# EAGLE design RC_Engine_Sound_ESP32 (EAGLE 9.6.2)
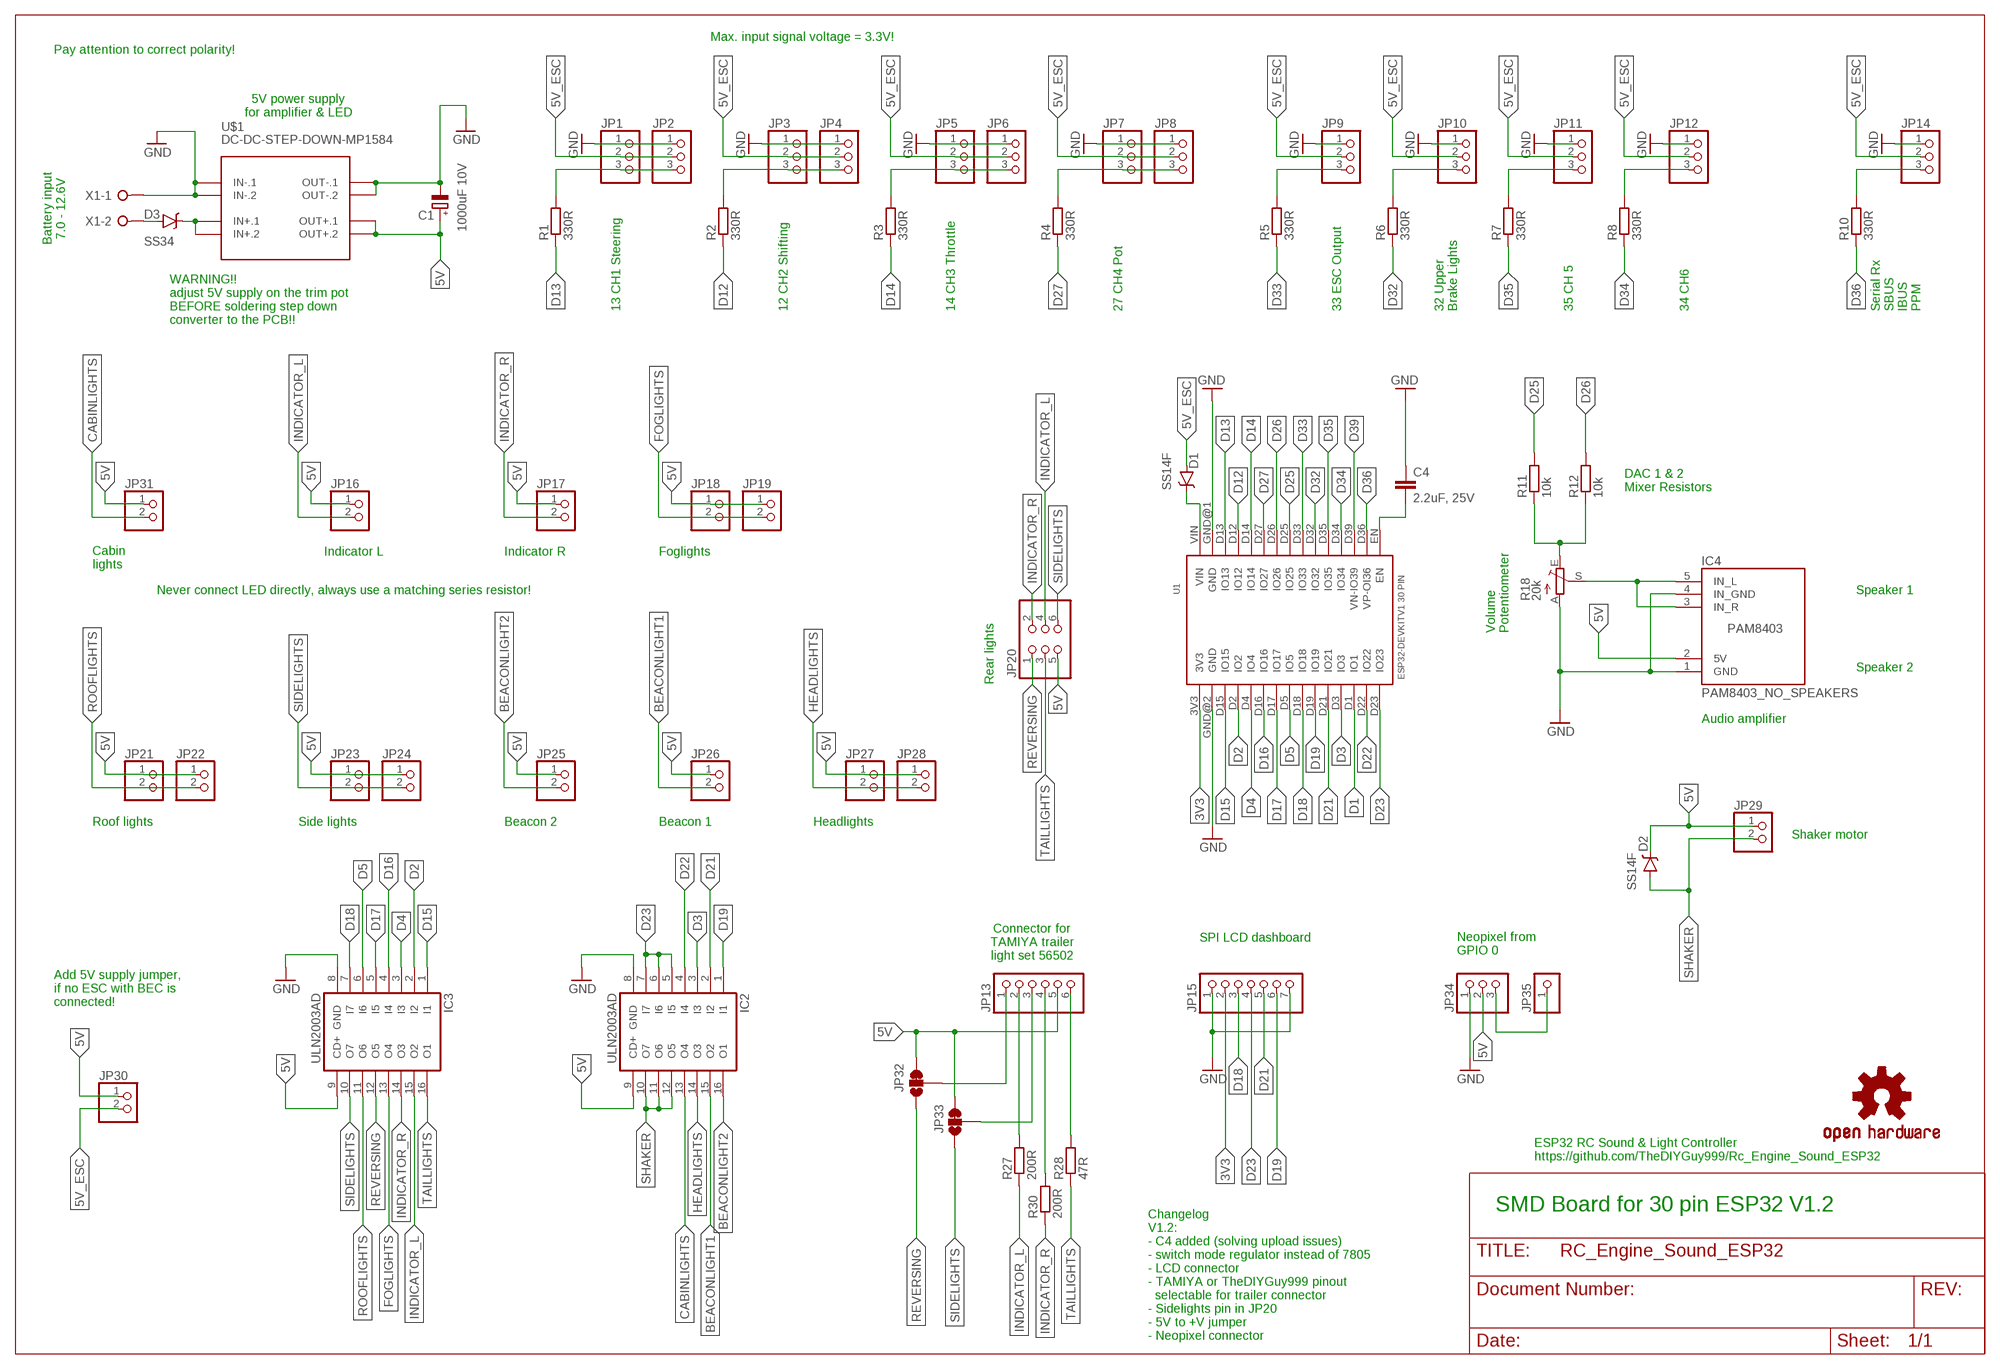
[diagram p0: schematic, sheet 1]

## Parts
C1  1000uF 10V  CPOL-EUUD-10X10  [UD-10X10_NICHICON]
C4  2.2uF, 25V  C-EUC1206  [C1206]
D1  SS14F  MBRA140  [SMA-DIODE]
D2  SS14F  MBRA140  [SMA-DIODE]
D3  SS34  MBRA140  [SMA-DIODE]
IC2  ULN2003AD  [SO16]
IC3  ULN2003AD  [SO16]
IC4  PAM8403_NO_SPEAKERS  [PAM8403_NO_SPEAKERS]
JP1  PINHD-1X3  [1X03]
JP2  PINHD-1X3  [1X03]
JP3  PINHD-1X3  [1X03]
JP4  PINHD-1X3  [1X03]
JP5  PINHD-1X3  [1X03]
JP6  PINHD-1X3  [1X03]
JP7  PINHD-1X3  [1X03]
JP8  PINHD-1X3  [1X03]
JP9  PINHD-1X3  [1X03]
JP10  PINHD-1X3  [1X03]
JP11  PINHD-1X3  [1X03]
JP12  PINHD-1X3  [1X03]
JP13  PINHD-1X6  [1X06]
JP14  PINHD-1X3  [1X03]
JP15  PINHD-1X7  [1X07]
JP16  PINHD-1X2  [1X02]
JP17  PINHD-1X2  [1X02]
JP18  PINHD-1X2  [1X02]
JP19  PINHD-1X2  [1X02]
JP20  PINHD-2X3  [2X03]
JP21  PINHD-1X2  [1X02]
JP22  PINHD-1X2  [1X02]
JP23  PINHD-1X2  [1X02]
JP24  PINHD-1X2  [1X02]
JP25  PINHD-1X2  [1X02]
JP26  PINHD-1X2  [1X02]
JP27  PINHD-1X2  [1X02]
JP28  PINHD-1X2  [1X02]
JP29  PINHD-1X2  [1X02]
JP30  PINHD-1X2  [1X02]
JP31  PINHD-1X2  [1X02]
JP32  JUMPER-PAD-3-2OF3_NC_BY_TRACE_LARGE  [PAD-JUMPER-3-2OF3_NC_BY_TRACE_YES_SILK_LARGE]
JP33  JUMPER-PAD-3-2OF3_NC_BY_TRACE_LARGE  [PAD-JUMPER-3-2OF3_NC_BY_TRACE_YES_SILK_LARGE]
JP34  PINHD-1X3  [1X03]
JP35  PINHD-1X1  [1X01]
LOGO1  OSHW-LOGOM  [OSHW-LOGO-M]
R1  330R  R-EU_R0805  [R0805]
R2  330R  R-EU_R0805  [R0805]
R3  330R  R-EU_R0805  [R0805]
R4  330R  R-EU_R0805  [R0805]
R5  330R  R-EU_R0805  [R0805]
R6  330R  R-EU_R0805  [R0805]
R7  330R  R-EU_R0805  [R0805]
R8  330R  R-EU_R0805  [R0805]
R10  330R  R-EU_R0805  [R0805]
R11  10k  R-EU_R0805  [R0805]
R12  10k  R-EU_R0805  [R0805]
R18  20k  TRIM_EU-S64W  [S64W]
R27  200R  R-EU_R0805  [R0805]
R28  47R  R-EU_R0805  [R0805]
R30  200R  R-EU_R0805  [R0805]
U1  ESP32DEVKITV1  [ESP32-DEVKITV1]
U$1  DC-DC-STEP-DOWN-MP1584  [DC-DC-STEP-DOWN-MP1584]
X1  W237-02P  [W237-132]

## Nets
3V3: JP15.2 U1.3V3
5V: C1.+ D2.C IC2.9(CD+) IC3.9(CD+) IC4.2(5V) JP13.5 JP16.1 JP17.1 JP18.1 JP19.1 JP20.5 JP21.1 JP22.1 JP23.1 JP24.1 JP25.1 JP26.1 JP27.1 JP28.1 JP29.1 JP30.1 JP31.1 JP32.3 JP33.3 JP34.2 U$1.OUT+.1 U$1.OUT+.2
5V_ESC: D1.A JP1.2 JP2.2 JP3.2 JP4.2 JP5.2 JP6.2 JP7.2 JP8.2 JP9.2 JP10.2 JP11.2 JP12.2 JP14.2 JP30.2
BEACONLIGHT1: IC2.15(O2) JP26.2
BEACONLIGHT2: IC2.16(O1) JP25.2
CABINLIGHTS: IC2.13(O4) JP31.2
D0: JP34.3 JP35.1
D1: U1.D1(IO1)
D2: IC3.2(I2) U1.D2(IO2)
D3: IC2.3(I3) U1.D3(IO3)
D4: IC3.3(I3) U1.D4(IO4)
D5: IC3.6(I6) U1.D5(IO5)
D12: R2.1 U1.D12(IO12)
D13: R1.1 U1.D13(IO13)
D14: R3.1 U1.D14(IO14)
D15: IC3.1(I1) U1.D15(IO15)
D16: IC3.4(I4) U1.D16(IO16)
D17: IC3.5(I5) U1.D17(IO17)
D18: IC3.7(I7) JP15.3 U1.D18(IO18)
D19: IC2.1(I1) JP15.6 U1.D19(IO19)
D21: IC2.2(I2) JP15.5 U1.D21(IO21)
D22: IC2.4(I4) U1.D22(IO22)
D23: IC2.5(I5) IC2.6(I6) IC2.7(I7) JP15.4 U1.D23(IO23)
D25: R11.2 U1.D25(IO25)
D26: R12.2 U1.D26(IO26)
D27: R4.1 U1.D27(IO27)
D32: R6.1 U1.D32(IO32)
D33: R5.1 U1.D33(IO33)
D34: R8.1 U1.D34(IO34)
D35: R7.1 U1.D35(IO35)
D36: R10.1 U1.D36(VP-OI36)
D39: U1.D39(VN-IO39)
FOGLIGHTS: IC3.13(O4) JP18.2 JP19.2
GND: C1.- C4.1 IC2.8(GND) IC3.8(GND) IC4.1(GND) IC4.4(IN_GND) JP1.1 JP2.1 JP3.1 JP4.1 JP5.1 JP6.1 JP7.1 JP8.1 JP9.1 JP10.1 JP11.1 JP12.1 JP14.1 JP15.1 JP15.7 JP34.1 R18.A U1.GND@1(GND) U1.GND@2(GND) U$1.IN-.1 U$1.IN-.2 U$1.OUT-.1 U$1.OUT-.2 X1.1
HEADLIGHTS: IC2.14(O3) JP27.2 JP28.2
INDICATOR_L: IC3.15(O2) JP16.2 JP20.4 R27.1
INDICATOR_R: IC3.14(O3) JP17.2 JP20.2 R30.1
N$1: IC4.3(IN_R) IC4.5(IN_L) R18.S
N$2: R11.1 R12.1 R18.E
N$3: JP1.3 JP2.3 R1.2
N$4: JP13.6 R28.2
N$5: JP3.3 JP4.3 R2.2
N$6: JP5.3 JP6.3 R3.2
N$7: JP7.3 JP8.3 R4.2
N$8: JP9.3 R5.2
N$9: D1.C U1.VIN
N$10: JP10.3 R6.2
N$11: JP11.3 R7.2
N$12: JP12.3 R8.2
N$13: JP13.4 R30.2
N$14: JP14.3 R10.2
N$15: JP13.2 R27.2
N$16: JP13.1 JP32.2
N$17: C4.2 U1.EN
N$18: JP13.3 JP33.2
N$19: D3.C U$1.IN+.1 U$1.IN+.2
N$20: D3.A X1.2
REVERSING: IC3.12(O5) JP20.1 JP32.1
ROOFLIGHTS: IC3.11(O6) JP21.2 JP22.2
SHAKER: D2.A IC2.10(O7) IC2.11(O6) IC2.12(O5) JP29.2
SIDELIGHTS: IC3.10(O7) JP20.6 JP23.2 JP24.2 JP33.1
TAILLIGHTS: IC3.16(O1) JP20.3 R28.1

## Notes on the sheet
- Max. input signal voltage = 3.3V!
- Pay attention to correct polarity!
- 5V power supply
  for amplifier & LED
- Battery input
  7.0 - 12.6V
- 13 CH1 Steering | 12 CH2 Shifting | 14 CH3 Throttle | 27 CH4 Pot | 33 ESC Output
- 32 Upper
  Brake Lights
- 35 CH 5 | 34 CH6
- Serial Rx
  SBUS
  IBUS
  PPM
- WARNING!!
  adjust 5V supply on the trim pot
  BEFORE soldering step down
  converter to the PCB!!
- DAC 1 & 2
  Mixer Resistors
- Indicator L | Indicator R | Foglights
- Cabin
  lights
- Never connect LED directly, always use a matching series resistor! | Speaker 1
- Volume
  Potentiometer
- Speaker 2
- Rear lights
- Audio amplifier
- Roof lights | Side lights | Beacon 2 | Beacon 1 | Headlights
- Shaker motor
- Connector for
  TAMIYA trailer
  light set 56502
- SPI LCD dashboard
- Neopixel from
  GPIO 0
- Add 5V supply jumper,
  if no ESC with BEC is
  connected!
- ESP32 RC Sound & Light Controller
  https://github.com/TheDIYGuy999/Rc_Engine_Sound_ESP32
- SMD Board for 30 pin ESP32 V1.2
- Changelog
  V1.2:
  - C4 added (solving upload issues)
  - switch mode regulator instead of 7805
  - LCD connector
  - TAMIYA or TheDIYGuy999 pinout
    selectable for trailer connector
  - Sidelights pin in JP20
  - 5V to +V jumper
  - Neopixel connector

## Library data of the parts
C1 = rcl:CPOL-EU: POLARIZED CAPACITOR, European symbol; SPICEPREFIX: C
C4 = rcl:C-EU: CAPACITOR, European symbol
D1-D3 = SparkFun-DiscreteSemi:MBRA140: 40V, 1A Schottky rectifier SMA/DO-214AC package DIO-08053; PROD_ID: DIO-08053
IC2 IC3 = uln-udn:ULN2003A: DRIVER ARRAY
IC4 = 00_custom:PAM8403_NO_SPEAKERS
JP1-JP12 JP14 JP34 = 00_custom_pinhead:PINHD-1X3: PIN HEADER
JP13 = 00_custom_pinhead:PINHD-1X6: PIN HEADER
JP15 = 00_custom_pinhead:PINHD-1X7: PIN HEADER
JP16-JP19 JP21-JP31 = 00_custom_pinhead:PINHD-1X2: PIN HEADER
JP20 = 00_custom_pinhead:PINHD-2X3: PIN HEADER
JP32 JP33 = SparkFun-Passives:JUMPER-PAD-3-2OF3_NC_BY_TRACE
JP35 = 00_custom_pinhead:PINHD-1X1: PIN HEADER
LOGO1 = SparkFun-Aesthetics:OSHW-LOGO: Open Source Hardware Logo This logo indicates the piece of hardware it is found on incorporates a OSHW license and/or adheres to the definition of open source hardware found here: http://freedomdefined.org/OSHW
R1-R8 R10-R12 R27 R28 R30 = rcl:R-EU_: RESISTOR, European symbol; SPICEPREFIX: R
R18 = pot:TRIM_EU-: POTENTIOMETER
U1 = ESP32-DEVKITV1_30pin:ESP32DEVKITV1
U$1 = 00_custom:DC-DC-STEP-DOWN-MP1584: DC/DC Step-Down Regulator based on MP1584 chip MP1584 datasheet available here: http://www.haoyuelectronics.com/Attachment/MP1584/MP1584.pdf Click here to find device on ebay.com <http://www.ebay.com/sch/mp1584+module>
X1 = con-wago-508:W237-02P: WAGO SREW CLAMP; OC_FARNELL: unknown; OC_NEWARK: unknown

## Net classes
0 5V: clearance 0.254 mm

## Board
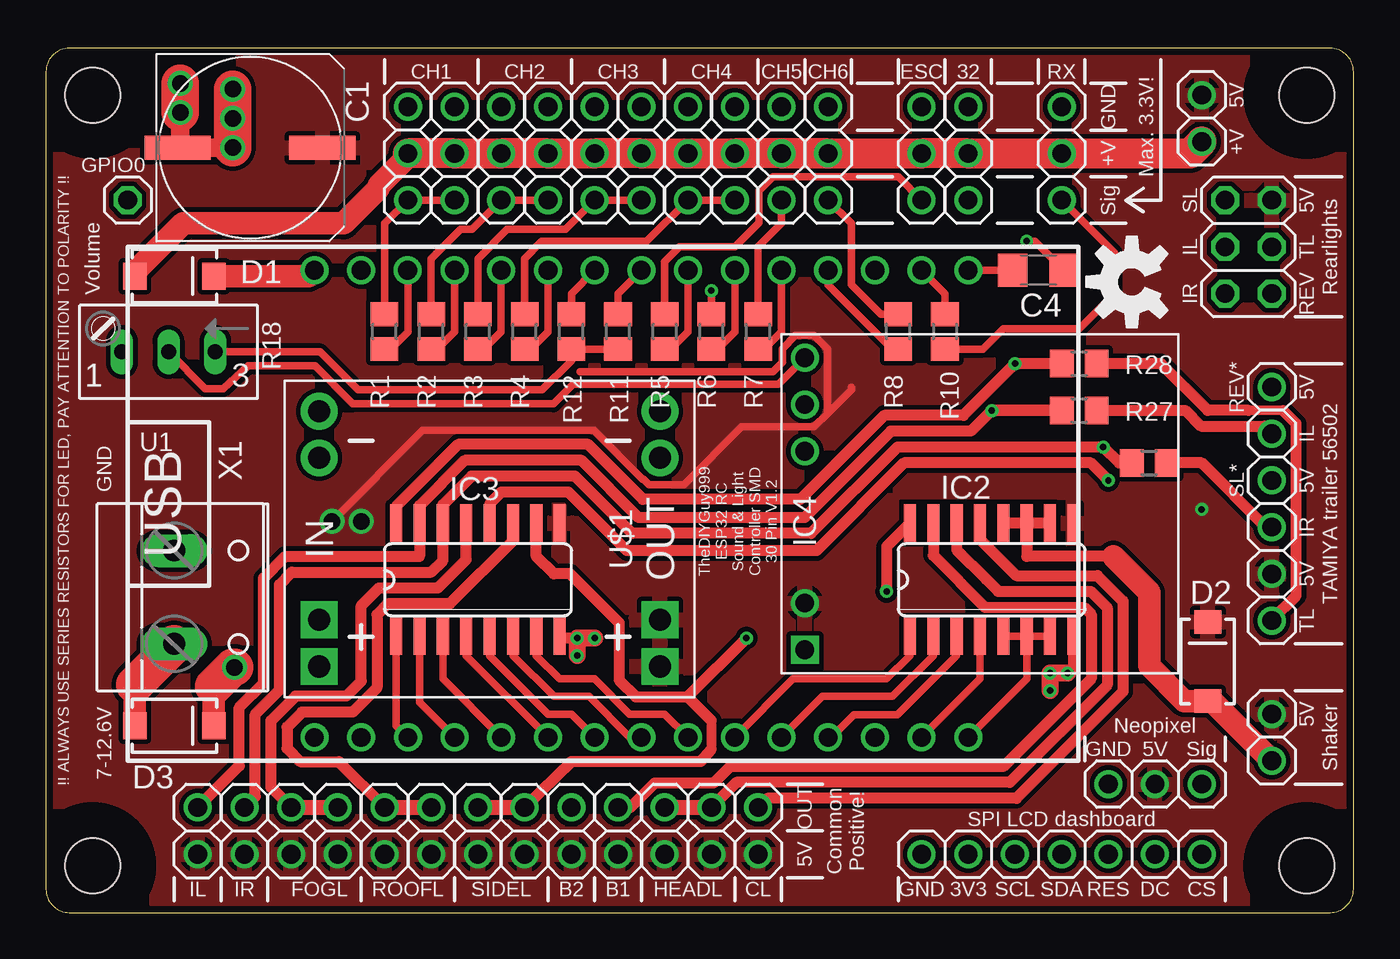
[diagram p1: board, top side]
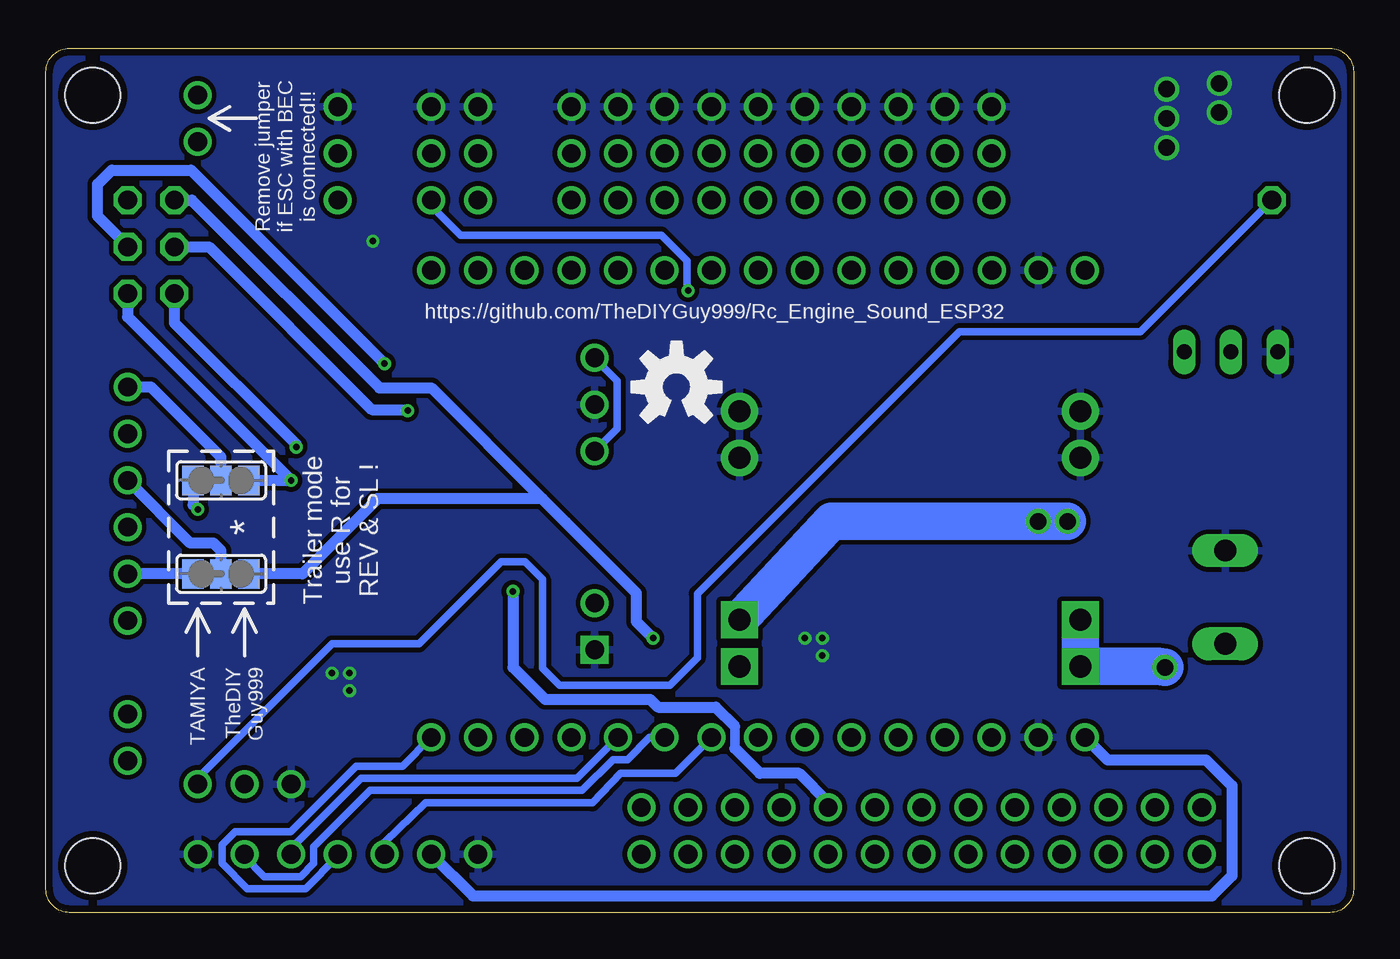
[diagram p2: board, bottom side, seen from below]

Size 71.12 x 46.99 mm. Coordinates in mm from the lower left corner, seen from the top.
Outline: 0,45.72 0,1.27 arc90 1.27,0 69.85,0 arc90 71.12,1.27 71.12,45.72 arc90 69.85,46.99 1.27,46.99 arc90 0,45.72
Copper layers (1*16): Top 0.0356mm / dielectric 1.5011mm / Bottom 0.0356mm
Design rules "OSHPark_LaenPCBOrder": minimum track width 6mil, minimum drill 13mil, track to track 6mil, track to pad 6mil, pad to pad 6mil, via to via 6mil, smd to smd 6mil, copper to edge 15mil, drill to drill 6mil, minimum pad ring 7mil, minimum via ring 7mil, stop-mask expansion 3mil, vias tented up to drill 0mil, thermal gap 10mil
Holes 3 mm at 2.54,44.45 2.54,2.54 68.58,2.54 68.58,44.45
tRestrict: area -0.7,41.2 to 5.8,47.7; area 65.3,41.2 to 71.8,47.7; area 65.3,-0.7 to 71.8,5.8; area -0.7,-0.7 to 5.8,5.8

### Footprints (pad centres in the part's own frame; a part is rotated, then mirrored left to right if it is on the bottom)
UD-10X10_NICHICON = smd 3.6 x 1.3: + 3.925,0; - -3.95,0
C1206 = smd 1.6 x 1.8: 1 -1.4,0; 2 1.4,0
SMA-DIODE = smd 1.27 x 1.47: A -2.15,0; C 2.15,0
SO16 = smd 0.66 x 2.032: 1 -4.445,-3.073; 2 -3.175,-3.073; 3 -1.905,-3.073; 4 -0.635,-3.073; 5 0.635,-3.073; 6 1.905,-3.073; 7 3.175,-3.073; 8 4.445,-3.073; 9 4.445,3.073; 10 3.175,3.073; 11 1.905,3.073; 12 0.635,3.073; 13 -0.635,3.073; 14 -1.905,3.073; 15 -3.175,3.073; 16 -4.445,3.073
PAM8403_NO_SPEAKERS = drill 1.016 square: 1 -7.62,8.89 | drill 1.016: 2 -5.08,8.89; 3 3.175,8.89; 4 5.715,8.89; 5 8.255,8.89
1X03 = drill 1.016 pad 1.524: 1 -2.54,0; 2 0,0; 3 2.54,0
1X06 = drill 1.016 pad 1.524: 1 -6.35,0; 2 -3.81,0; 3 -1.27,0; 4 1.27,0; 5 3.81,0; 6 6.35,0
1X07 = drill 1.016: 1 -7.62,0; 2 -5.08,0; 3 -2.54,0; 4 0,0; 5 2.54,0; 6 5.08,0; 7 7.62,0
1X02 = drill 1.016 pad 1.524: 1 -1.27,0; 2 1.27,0
2X03 = drill 1.016 octagon: 1 -2.54,-1.27; 2 -2.54,1.27; 3 0,-1.27; 4 0,1.27; 5 2.54,-1.27; 6 2.54,1.27
PAD-JUMPER-3-2OF3_NC_BY_TRACE_YES_SILK_LARGE = smd 1.168 x 1.6: 1 -1.524,0; 2 0,0; 3 1.524,0
1X01 = drill 1.016 octagon: 1 0,0
R0805 = smd 1.3 x 1.5: 1 -0.95,0; 2 0.95,0
S64W = drill 0.813 long: A 2.54,1.27; E -2.54,1.27; S 0,1.27
ESP32-DEVKITV1 = drill 1.016: 3V3 -16.51,-12.7; D1 13.97,-12.7; D2 -8.89,-12.7; D3 11.43,-12.7; D4 -6.35,-12.7; D5 1.27,-12.7; D12 -8.89,12.7; D13 -11.44,12.7; D14 -6.35,12.7; D15 -11.43,-12.7; D16 -3.81,-12.7; D17 -1.27,-12.7; D18 3.81,-12.7; D19 6.35,-12.7; D21 8.89,-12.7; D22 16.51,-12.7; D23 19.05,-12.7; D25 1.27,12.7; D26 -1.27,12.7; D27 -3.81,12.7; D32 6.35,12.7; D33 3.81,12.7; D34 11.43,12.7; D35 8.89,12.7; D36 16.51,12.7; D39 13.97,12.7; EN 19.05,12.7; GND@1 -13.97,12.7; GND@2 -13.97,-12.7; VIN -16.51,12.7
DC-DC-STEP-DOWN-MP1584 = drill 1.2 pad 2 square: IN+.1 -9.271,-4.4; IN+.2 -9.271,-6.94; OUT+.1 9.271,-4.4; OUT+.2 9.271,-6.94 | drill 1.2 pad 2: IN-.1 -9.271,6.94; IN-.2 -9.271,4.4; OUT-.1 9.271,6.94; OUT-.2 9.271,4.4
W237-132 = drill 1.194 long: 1 -2.54,-0.635; 2 2.54,-0.635

### Placement (x,y rotation side)
C1  11.11,41.59 0 top
C4  53.98,34.92 180 top
D1  6.99,34.61 0 top
D2  63.18,13.65 90 top
D3  6.99,10.16 0 top
IC2  51.44,18.1 0 top
IC3  23.49,18.1 0 top
IC4  50.16,21.91 90 top
JP1  19.68,41.27 270 top
JP2  22.22,41.27 270 top
JP3  24.76,41.27 270 top
JP4  27.3,41.27 270 top
JP5  29.84,41.27 270 top
JP6  32.39,41.27 270 top
JP7  34.93,41.27 270 top
JP8  37.47,41.27 270 top
JP9  47.62,41.27 270 top
JP10  50.16,41.27 270 top
JP11  40.01,41.27 270 top
JP12  42.55,41.27 270 top
JP13  66.67,22.23 270 top
JP14  55.25,41.27 270 top
JP15  55.25,3.17 0 top
JP16  8.26,4.45 90 top
JP17  10.79,4.45 90 top
JP18  13.34,4.45 90 top
JP19  15.88,4.45 90 top
JP20  65.41,36.2 90 top
JP21  18.41,4.45 90 top
JP22  20.95,4.45 90 top
JP23  23.49,4.45 90 top
JP24  26.04,4.45 90 top
JP25  28.57,4.45 90 top
JP26  31.11,4.45 90 top
JP27  33.66,4.45 90 top
JP28  36.2,4.45 90 top
JP29  66.67,9.53 270 top
JP30  62.87,43.18 270 top
JP31  38.73,4.45 90 top
JP32  61.59,23.5 180 bottom
JP33  61.59,18.42 180 bottom
JP34  60.33,6.98 0 top
JP35  4.45,38.73 0 top
LOGO1  59.05,34.29 90 top
LOGO2  OSHW-LOGOM  [OSHW-LOGO-M]  36.83,28.58 0 bottom
R1  18.41,31.59 90 top
R2  20.95,31.59 90 top
R3  23.49,31.59 90 top
R4  26.04,31.59 90 top
R5  33.66,31.59 90 top
R6  36.2,31.59 90 top
R7  38.73,31.59 90 top
R8  46.36,31.59 90 top
R10  48.9,31.59 270 top
R11  31.11,31.59 90 top
R12  28.57,31.59 90 top
R18  6.67,31.75 180 top
R27  56.2,27.31 0 top
R28  56.2,29.85 0 top
R30  60.01,24.45 0 top
U1  31.11,22.23 0 top
U$1  24.13,20.32 0 top
X1  7.62,17.15 270 top

### Tracks (layer width: path | path; a pad name or v marks a point on that pad's centre or on a via)
3V3
  Bottom 0.61: U1.3V3 13.39,8.31 8.03,8.31 6.62,6.9 6.62,1.99 7.71,0.9 47.89,0.9 JP15.2
5V  (via drill 0.35, 0.9)
  Top 0.406: v15.56,21.27 20.5,26.21 29.8,26.21 32.45,23.56 32.5,23.56 32.8,23.26 34.69,23.26 37.83,26.4 41.78,26.4 42.49,27.12 | 42.49,27.12 42.49,30.67 41.78,31.38 40.77,31.38 40.06,30.67 40.06,29.92 39.53,29.39 29.05,29.39 | 42.49,27.12 43.82,28.44 43.82,28.58
  Bottom 0.61: JP13.5 66.17,18.42 JP33.3 | JP32.3 63.12,22.16 v62.87,21.92
  Bottom 2.032: U$1.OUT+.1 28.38,21.27 v17.14,21.27 v15.56,21.27
  pour Top: -3.13,-1.91 -3.13,19.52 -2.8,48.89 73.02,48.89 73.02,-1.91
5V_ESC
  Top 1.219: JP1.2 19.68,41.12 18.1,39.53 18.1,39.37 16.19,37.46 7.46,37.46 4.83,34.84 D1.A
  Top 1.626: JP12.2 JP11.2 | JP11.2 JP9.2 JP10.2 JP14.2 62.23,41.27 JP30.2 | JP11.2 JP8.2 JP7.2 JP6.2 JP5.2 JP4.2 JP3.2 JP2.2 JP1.2
BEACONLIGHT1
  Top 0.61: IC2.15 48.26,19.42 51.08,16.6 56.48,16.6 56.86,16.22 56.86,12.72 52.07,7.94 37.2,7.94 36.29,7.04 33.11,7.04 31.79,5.71 JP26.2
BEACONLIGHT2  (via drill 0.35)
  Top 0.61: IC2.16 45.72,19.9 v45.72,17.46
  Bottom 0.508: 33.66,10.12 33.66,8.93
  Bottom 0.61: v45.72,17.46 45.72,13.33 43.97,11.59 38.26,11.59 37.83,11.16 34.7,11.16 33.66,10.12 | 33.66,8.93 32.3,7.57 30.15,7.57 28.57,6 JP25.2
CABINLIGHTS
  Top 0.61: JP31.2 39.23,6.21 52.79,6.21 58.58,12.01 58.58,16.93 57.19,18.33 52.78,18.33 50.8,20.3 IC2.13
D0
  Bottom 0.406: JP34.3 62.87,7.3 55.56,14.61 50.83,14.61 46.37,19.07 45.07,19.07 44.12,18.12 44.12,13.29 43.2,12.37 37.16,12.37 35.69,13.84 35.69,17.34 21.43,31.59 11.59,31.59 JP35.1
D2
  Top 0.406: IC3.2 20.32,11.43 U1.D2
D3
  Top 0.406: IC2.3 49.53,13.97 46.3,10.74 43.95,10.74 42.73,9.53 U1.D3
D4
  Top 0.406: IC3.3 21.59,12.7 U1.D4
D5
  Top 0.406: U1.D5 31.75,9.53 29.53,11.75 27.62,11.75 25.4,13.97 IC3.6
D12
  Top 0.406: U1.D12 22.22,31.59 21.27,30.64 R2.1
D13
  Top 0.406: U1.D13 19.68,31.59 18.73,30.64 R1.1
D14
  Top 0.406: U1.D14 24.76,31.59 23.81,30.64 R3.1
D15
  Top 0.406: IC3.1 19.05,10.16 U1.D15
D16
  Top 0.406: U1.D16 22.86,13.97 IC3.4
D17
  Top 0.406: U1.D17 28.57,10.79 27.3,10.79 24.13,13.97 IC3.5
D18
  Top 0.406: IC3.7 26.67,13.97 27.94,12.7 29.84,12.7 31.75,10.79 33.66,10.79 U1.D18
  Bottom 0.406: U1.D18 36.88,7.57 39.88,7.57 41.4,5.97 50.48,5.97 52.71,3.81 JP15.3
D19
  Top 0.406: U1.D19 40.64,12.7 45.72,12.7 46.99,13.97 IC2.1
  Bottom 0.406: U1.D19 38.28,9.53 39.5,8.31 40.29,8.31 41.95,6.64 53.5,6.64 56.57,3.58 56.57,2.67 57.28,1.96 59.24,1.96 60.33,3.04 JP15.6
D21
  Top 0.406: IC2.2 48.26,13.97 46.04,11.75 42.23,11.75 U1.D21
  Bottom 0.406: U1.D21 42.23,7.3 53.98,7.3 57.79,3.49 JP15.5
D22
  Top 0.406: IC2.4 50.8,12.7 U1.D22
D23
  Top 0.406: IC2.7 IC2.6 | IC2.6 IC2.5 | IC2.6 53.34,12.7 U1.D23
  Bottom 0.406: U1.D23 51.73,7.96 54.25,7.96 57.82,4.39 60.83,4.39 61.54,3.68 61.54,2.67 60.17,1.29 57.01,1.29 55.25,3.06 JP15.4
D25
  Top 0.406: R11.2 31.11,33.66 U1.D25
D26
  Top 0.406: R12.2 28.57,33.66 U1.D26
D27
  Top 0.406: U1.D27 27.3,31.59 26.35,30.64 R4.1
D32
  Top 0.406: U1.D32 37.47,31.59 36.52,30.64 R6.1
D33
  Top 0.406: U1.D33 34.93,31.59 33.98,30.64 R5.1
D34
  Top 0.406: U1.D34 42.55,34.13 46.04,30.64 R8.1
D35
  Top 0.406: U1.D35 40.01,31.59 39.05,30.64 R7.1
D36
  Top 0.406: U1.D36 48.9,33.66 R10.1
FOGLIGHTS
  Top 0.61: IC3.13 22.86,19.19 21.31,17.64 18.1,17.64 17.14,16.69 17.14,12.58 16.33,11.77 13.57,11.77 12.24,10.44 12.24,6.81 JP18.2
  Top 0.813: JP18.2 JP19.2
GND  (via drill 0.35, 0.9)
  Top 0.406: C4.1 53.79,36.51 v53.34,36.51
  Top 0.61: IC2.8 55.88,13.33 v55.56,13.02 | v28.89,14.92 28.04,14.92 IC3.8
  Top 0.914: v55.56,13.02 v54.61,13.02 v54.61,12.06 | v29.84,14.92 v28.89,14.92 v28.89,13.97
  Top 1.016: v7.3,43.5 7.3,41.73 C1.- v10.16,41.59
  Top 2.032: v10.16,41.59 v10.16,44.77 | v7.3,43.5 v7.3,45.09
  other vias: 10.16,43.18
  pour Bottom: -0.64,47.62 71.75,47.62 71.75,-0.64 -0.64,-0.64
HEADLIGHTS
  Top 0.61: JP28.2 37.55,7.07 52.43,7.07 57.72,12.37 57.72,16.57 56.83,17.46 51.8,17.46 51.14,18.12 49.53,19.73 IC2.14
  Top 0.813: JP27.2 JP28.2
INDICATOR_L  (via drill 0.35)
  Top 0.61: v51.45,27.29 51.46,27.31 R27.1 v51.44,27.31 50.31,26.18 45.96,26.18 41.26,21.48 32.24,21.48 29.13,24.59 22.78,24.59 20.32,22.13 IC3.15 20.32,19.37 13.02,19.37 11.84,18.19 11.84,12.47 10.52,11.15 10.52,7.98 JP16.2
  Bottom 0.61: JP20.4 62.25,36.2 53.4,27.35 51.48,27.35 v51.44,27.31 v51.45,27.29
INDICATOR_R  (via drill 0.35)
  Top 0.61: R30.1 58.37,24.45 v57.51,25.31 46.32,25.31 41.62,20.61 31.88,20.61 28.77,23.72 23.14,23.72 21.59,22.18 IC3.14 21.59,19.14 20.95,18.5 13.38,18.5 12.7,17.83 12.7,12.11 11.38,10.79 11.38,6.3 JP17.2
  Bottom 0.61: JP20.2 64.13,32.07 57.47,25.4 57.47,25.35 v57.51,25.31
N$1
  Top 0.406: IC4.5 40.01,28.89 39.85,28.73 34.45,28.73 28.68,28.73 27.6,27.65 16.67,27.65 14.63,29.72 11.01,29.72 9.65,28.49 8.66,28.49 R18.S
  Bottom 0.406: IC4.5 41.27,30.14 40.06,28.92 40.06,26.3 IC4.3
N$2
  Top 0.406: R11.1 R12.1 28.57,30.01 26.98,28.42 16.99,28.42 14.92,30.48 R18.E
N$3
  Top 0.406: R1.2 18.41,37.46 JP1.3 JP2.3
N$4
  Top 0.508: 67.27,27.31 65.41,27.31
  Top 0.61: 67.27,27.31 68,26.58 68,17.23 66.67,15.91 JP13.6 | 65.41,27.31 63.18,27.31 60.64,29.85 R28.2
N$5
  Top 0.406: R2.2 20.95,35.56 22.54,37.15 23.18,37.15 JP3.3 JP4.3
N$6
  Top 0.406: JP6.3 JP5.3 28.26,37.15 25.08,37.15 23.49,35.56 R3.2
N$7
  Top 0.406: JP8.3 JP7.3 32.68,36.49 26.96,36.49 26.04,35.56 R4.2
N$8
  Top 0.406: JP9.3 46.36,40 39.55,40 38.79,39.24 38.79,37.52 37.47,36.2 34.47,36.2 33.66,35.38 R5.2
N$9
  Top 1.219: D1.C 14.29,34.61 U1.VIN
N$10  (via drill 0.35)
  Top 0.406: R6.2 v36.2,33.81
  Bottom 0.406: v36.2,33.81 36.25,33.86 36.25,35.43 37.65,36.83 48.58,36.83 50.16,38.42 JP10.3
N$11
  Top 0.406: R7.2 38.73,36.2 40.01,37.46 JP11.3
N$12
  Top 0.406: JP12.3 43.82,37.46 43.82,34.13 45.41,32.54 R8.2
N$13
  Top 0.61: R30.2 62.87,24.45 66.36,20.96 JP13.4
N$14
  Top 0.406: R10.2 50.96,30.64 52.07,31.75 56.2,31.75 58.1,33.66 58.1,35.88 JP14.3
N$15
  Top 0.61: JP13.2 66.27,26.44 62.83,26.44 61.96,27.31 R27.2
N$16
  Bottom 0.61: JP32.2 61.59,24.77 65.41,28.58 JP13.1
N$17
  Top 0.406: U1.EN C4.2
N$18
  Bottom 0.61: JP33.2 61.59,19.69 62,20.09 63.27,20.09 JP13.3
N$19  (via drill 0.9)
  Top 1.219: D3.C 9.13,12.31
  Top 2.032: 9.13,12.31 10.16,13.33 v10.26,13.33
  Bottom 2.032: U$1.IN+.1 U$1.IN+.2 10.64,13.38 v10.26,13.33
N$20
  Top 1.219: D3.A 4.83,12.06 4.83,12.38
  Top 2.032: 4.83,12.38 6.99,14.53 X1.2
REVERSING  (via drill 0.35)
  Top 0.61: v57.79,23.5 56.83,24.45 46.67,24.45 41.91,19.69 31.59,19.69 28.42,22.86 26.35,22.86 24.76,22.86 24.13,22.23 IC3.12
  Bottom 0.61: JP20.1 66.67,32.38 v57.79,23.5 JP32.1
ROOFLIGHTS
  Top 0.61: IC3.11 25.4,20.22 21.96,16.78 18.59,16.78 18.01,16.19 18.01,12.22 16.69,10.9 13.93,10.9 13.11,10.08 13.11,8.93 13.83,8.2 15.93,8.2 JP21.2
  Top 0.813: JP21.2 JP22.2
SHAKER
  Top 0.61: IC2.10 IC2.11 | IC2.11 IC2.12 | IC2.11 53.34,19.37 58.05,19.37
  Top 1.219: 58.05,19.37 60.01,17.41 60.01,13.41 61.91,11.5 D2.A 63.43,11.5 JP29.2
SIDELIGHTS  (via drill 0.35)
  Top 0.508: 36.2,10.44 36.2,10.12 36.2,9.53 36.2,8.89
  Top 0.61: 36.2,8.89 35.6,8.2 28.57,8.2 JP24.2 | 36.2,10.44 34.91,11.73 | IC3.10 26.67,19.37 27.62,18.42 28.52,18.42 31.18,15.75 31.18,12.64 32.09,11.73 34.91,11.73 | v38.1,14.92 34.91,11.73
  Top 0.813: JP23.2 JP24.2
  Bottom 0.61: v38.1,14.92 39,15.82 39,17.38 42.86,21.23 44.13,22.5 | JP33.1 57.17,18.42 53.08,22.5 44.13,22.5 | JP20.6 63.18,38.73 52.97,28.53 50.15,28.53 44.13,22.5
TAILLIGHTS  (via drill 0.35)
  Top 0.61: R28.1 v52.71,29.85 49.9,27.04 45.6,27.04 41.03,22.47 32.47,22.47 29.49,25.45 22.42,25.45 19.05,22.08 IC3.16
  Bottom 0.61: JP20.3 66.67,36.23 68.31,37.87 68.31,39.6 67.54,40.37 63.23,40.37 v52.71,29.85

### Text on the board
tNames: CH1 | CH2 | CH3 | CH4 | CH5 | CH6 | ESC | 32 | RX | 5V | GND | +V | +V | GPIO0 | Max. 3.3V! | Sig | SL | 5V | IL | TL | Rearlights | Volume | IR | REV | REV* | 5V | IL | !! ALWAYS USE SERIES RESISTORS FOR LED, PAY ATTENTION TO POLARITY !! | GND | SL* | 5V | TAMIYA trailer 56502 | TheDIYGuy999 / ESP32 RC / Sound & Light / Controller SMD / 30 Pin V1.2 | IR | 5V | TL | Neopixel | 5V | 7-12.6V | Shaker | GND | 5V | Sig | OUT | Common / Positive! | SPI LCD dashboard | 5V | IL | IR | FOGL | ROOFL | SIDEL | B2 | B1 | HEADL | CL | GND | 3V3 | SCL | SDA | RES | DC | CS
bNames: Remove jumper / if ESC with BEC / is connected!! | https://github.com/TheDIYGuy999/Rc_Engine_Sound_ESP32 | Trailer mode / use R for / REV & SL ! | * | TheDIY / Guy999 | TAMIYA